# EAGLE design OGX360I-4CH - Programming Utility (EAGLE 9.6.2)
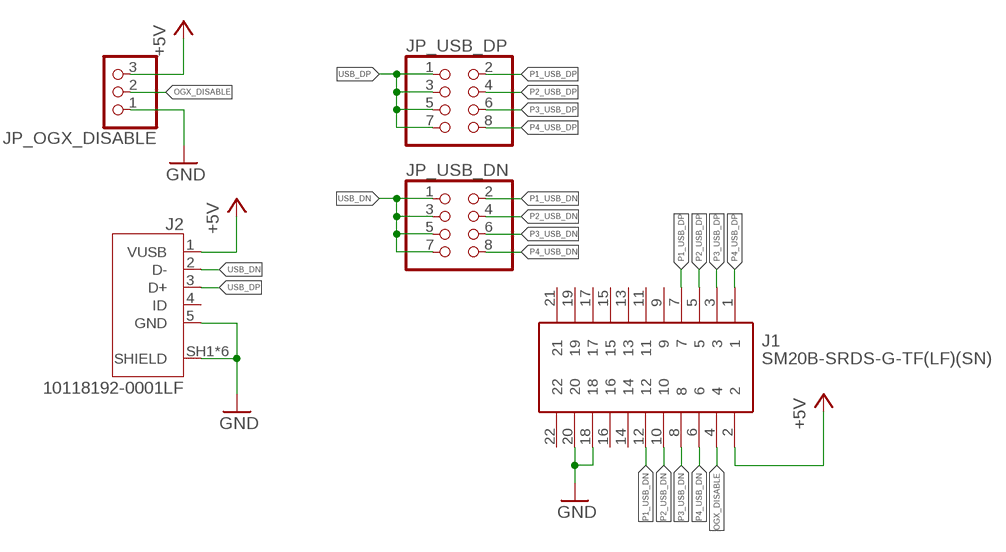
[diagram p0: schematic, sheet 1]

## Parts
J1  SM20B-SRDS-G-TF(LF)(SN)  [SM20BSRDSGTFLFSN]
J2  10118192-0001LF  [AMPHENOL_10118192-0001LF]
JP_OGX_DISABLE  PINHD-1X3  [1X03]
JP_USB_DN  PINHD-2X4  [2X04]
JP_USB_DP  PINHD-2X4  [2X04]

## Nets
+5V: J1.2 J2.1(VUSB) JP_OGX_DISABLE.3
GND: J1.18 J1.20 J2.5(GND) J2.SH1(SHIELD) J2.SH2(SHIELD) J2.SH3(SHIELD) J2.SH4(SHIELD) J2.SH5(SHIELD) J2.SH6(SHIELD) JP_OGX_DISABLE.1
OGX_DISABLE: J1.4 JP_OGX_DISABLE.2
P1_USB_DN: J1.12 JP_USB_DN.2
P1_USB_DP: J1.7 JP_USB_DP.2
P2_USB_DN: J1.10 JP_USB_DN.4
P2_USB_DP: J1.5 JP_USB_DP.4
P3_USB_DN: J1.8 JP_USB_DN.6
P3_USB_DP: J1.3 JP_USB_DP.6
P4_USB_DN: J1.6 JP_USB_DN.8
P4_USB_DP: J1.1 JP_USB_DP.8
USB_DN: J2.2(D-) JP_USB_DN.1 JP_USB_DN.3 JP_USB_DN.5 JP_USB_DN.7
USB_DP: J2.3(D+) JP_USB_DP.1 JP_USB_DP.3 JP_USB_DP.5 JP_USB_DP.7
Unconnected: J1.9 J1.11 J1.13 J1.14 J1.15 J1.16 J1.17 J1.19 J1.21 J1.22 J2.4(ID)

## Library data of the parts
J1 = SM20B-SRDS-G-TFLFSN:SM20B-SRDS-G-TF(LF)(SN): JST SHD, 1mm Pitch, 20 Way, Right Angle PCB Header, Surface Mount Source: Datasheet <http://www.jst-mfg.com/product/pdf/eng/eSHD.pdf>; DESCRIPTION: JST SHD, 1mm Pitch, 20 Way, Right Angle PCB Header, Surface Mount; HEIGHT: 5.5mm; MANUFACTURER_NAME: JST (JAPAN SOLDERLESS TERMINALS); MANUFACTURER_PART_NUMBER: SM20B-SRDS-G-TF(LF)(SN)
J2 = 10118192-0001LF:10118192-0001LF: Single Port 5 Contact Horizontal Right Angle Shielded Micro B USB 2.0 Connector Check prices <https://snapeda.com/parts/10118192-0001LF/Amphenol%20ICC%20%28FCI%29/view-part/?ref=eda>; ARROW_ELECTRONICS-PURCHASE-URL: https://snapeda.com/shop?store=Arrow+Electronics&id=4793801; AVAILABILITY: Good; DESCRIPTION: USB - micro B USB 2.0 Receptacle Connector 5 Position Surface Mount, Right Angle; DIGIKEY-PURCHASE-URL: https://snapeda.com/shop?store=DigiKey&id=4793801; MF: Amphenol ICC (FCI); MOUSER-PURCHASE-URL: https://snapeda.com/shop?store=Mouser&id=4793801; MP: 10118192-0001LF; PACKAGE: None; PRICE: None
JP_OGX_DISABLE = pinhead:PINHD-1X3: PIN HEADER
JP_USB_DN JP_USB_DP = pinhead:PINHD-2X4: PIN HEADER

## Board
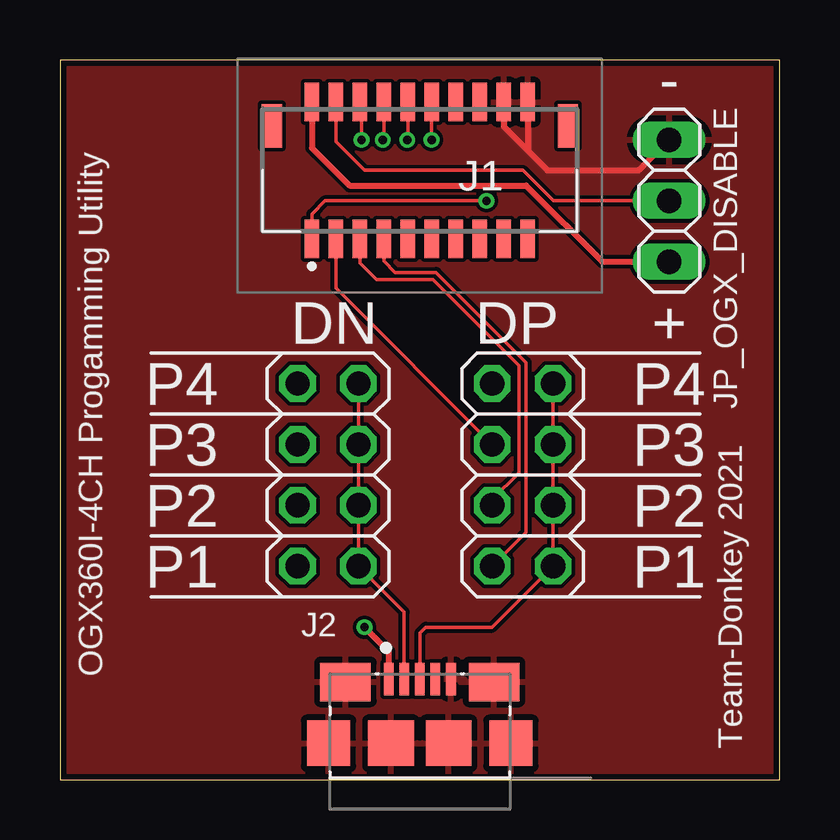
[diagram p1: board, top side]
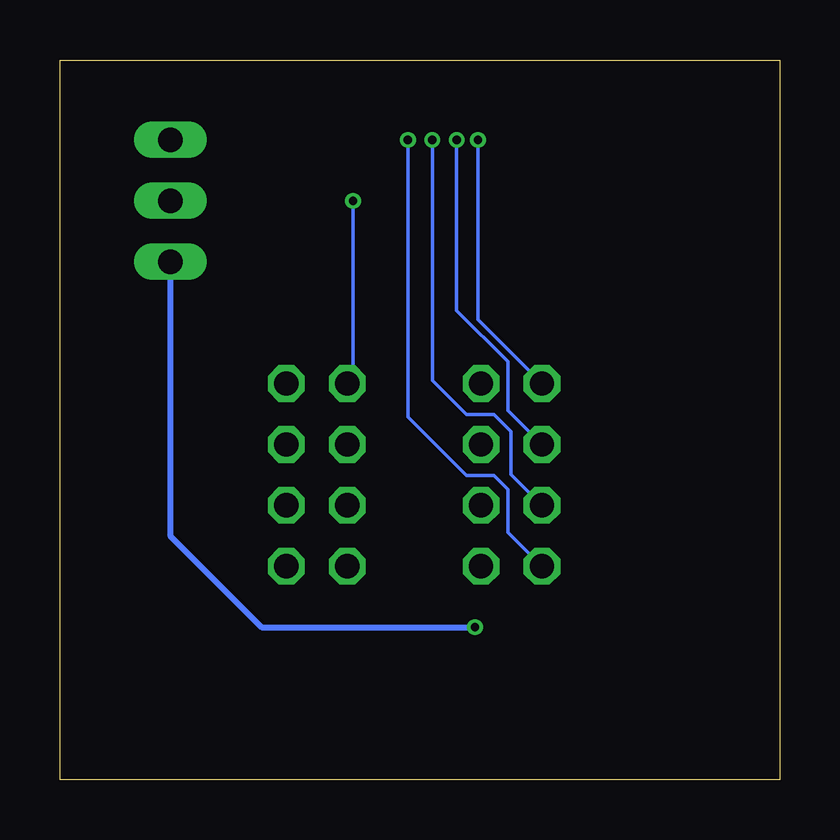
[diagram p2: board, bottom side, seen from below]

Size 30 x 30 mm. Coordinates in mm from the lower left corner, seen from the top.
Outline: 0,0 30,0 30,30 0,30 0,0
Copper layers (1*16): Top 0.035mm / dielectric 0.15mm / Bottom 0.035mm
Design rules "default": minimum track width 6mil, minimum drill 12mil, track to track 6mil, track to pad 6mil, pad to pad 6mil, via to via 6mil, smd to smd 0mil, copper to edge 10mil, drill to drill 10mil, minimum pad ring 10mil, minimum via ring 6mil, stop-mask expansion 2mil, vias tented up to drill 100mil, thermal gap 10mil

### Footprints (pad centres in the part's own frame; a part is rotated, then mirrored left to right if it is on the bottom)
SM20BSRDSGTFLFSN = smd 0.6 x 1.6: 1 4.5,2.85; 2 4.5,-2.85; 3 3.5,2.85; 4 3.5,-2.85; 5 2.5,2.85; 6 2.5,-2.85; 7 1.5,2.85; 8 1.5,-2.85; 9 0.5,2.85; 10 0.5,-2.85; 11 -0.5,2.85; 12 -0.5,-2.85; 13 -1.5,2.85; 14 -1.5,-2.85; 15 -2.5,2.85; 16 -2.5,-2.85; 17 -3.5,2.85; 18 -3.5,-2.85; 19 -4.5,2.85; 20 -4.5,-2.85 | smd 0.85 x 1.8: 21 -6.175,-1.85; 22 6.175,-1.85
AMPHENOL_10118192-0001LF = smd 0.4 x 1.35: 1 -1.3,0; 2 -0.65,0; 3 0,0; 4 0.65,0; 5 1.3,0 | smd 2.1 x 1.6: SH1 -3.1,-0.125; SH2 3.1,-0.125 | smd 1.8 x 1.9: SH3 -3.8,-2.675; SH6 3.8,-2.675 | smd 1.9 x 1.9: SH4 -1.2,-2.675; SH5 1.2,-2.675
1X03 = drill 1.016 long: 1 -2.54,0; 2 0,0; 3 2.54,0
2X04 = drill 1.016 octagon: 1 -3.81,-1.27; 2 -3.81,1.27; 3 -1.27,-1.27; 4 -1.27,1.27; 5 1.27,-1.27; 6 1.27,1.27; 7 3.81,-1.27; 8 3.81,1.27

### Placement (x,y rotation side)
J1  15,25.4 180 top
J2  15,4.19 0 top
JP_OGX_DISABLE  25.4,24.13 270 top
JP_USB_DN  11.18,12.7 90 top
JP_USB_DP  19.29,12.7 90 top

### Tracks (layer width: path | path; a pad name or v marks a point on that pad's centre or on a via)
+5V  (via drill 0.35)
  Top 0.254: J1.2 10.5,26.33 12.06,24.77 19.43,24.77 22.61,21.59 JP_OGX_DISABLE.3 | v12.7,6.35 13.7,5.35 J2.1
  Bottom 0.254: JP_OGX_DISABLE.3 25.4,10.16 21.59,6.35 v12.7,6.35
GND
  Top 0.254: J1.18 18.5,27.22 19.5,26.22 | 19.5,26.22 20.32,25.4 24.13,25.4 JP_OGX_DISABLE.1 | J1.20 19.5,26.22
  pour Top: -1.27,30.48 30.48,30.48 30.48,-1.27 -1.27,-1.27
OGX_DISABLE
  Top 0.152: J1.4 11.5,26.6 12.7,25.4 19.3,25.4 20.57,24.13 JP_OGX_DISABLE.2
P1_USB_DN  (via drill 0.35)
  Top 0.152: v15.49,26.67 J1.12
  Bottom 0.152: JP_USB_DN.2 11.33,10.31 11.33,12.09 11.91,12.68 13.06,12.68 15.49,15.11 v15.49,26.67
P1_USB_DP
  Top 0.152: J1.7 13.5,21.62 13.98,21.14 15.68,21.14 19.43,17.39 19.43,10.3 JP_USB_DP.2
P2_USB_DN  (via drill 0.35)
  Top 0.152: v14.48,26.67 14.5,26.69 J1.10
  Bottom 0.152: JP_USB_DN.4 11.2,12.72 11.2,14.51 11.91,15.21 13.06,15.21 14.48,16.63 v14.48,26.67
P2_USB_DP
  Top 0.152: J1.5 12.5,21.54 13.2,20.84 15.55,20.84 19.13,17.26 19.13,12.78 18.02,11.67 JP_USB_DP.4
P3_USB_DN  (via drill 0.35)
  Top 0.152: v13.46,26.67 13.5,26.71 J1.8
  Bottom 0.152: JP_USB_DN.6 11.33,15.39 11.33,17.43 13.46,19.56 v13.46,26.67
P3_USB_DP
  Top 0.152: JP_USB_DP.6 11.5,20.49 J1.3
P4_USB_DN  (via drill 0.35)
  Top 0.152: v12.57,26.67 12.57,28.18 J1.6
  Bottom 0.152: JP_USB_DN.8 12.57,19.18 v12.57,26.67
P4_USB_DP  (via drill 0.35)
  Top 0.152: v17.78,24.13 11.05,24.13 10.5,23.58 J1.1
  Bottom 0.152: JP_USB_DP.8 17.78,16.75 v17.78,24.13
USB_DN
  Top 0.152: J2.2 14.35,6.99 JP_USB_DN.1 JP_USB_DN.3 JP_USB_DN.5 JP_USB_DN.7
USB_DP
  Top 0.152: J2.3 15,6.11 15.24,6.35 18.02,6.35 JP_USB_DP.1 JP_USB_DP.3 JP_USB_DP.5 JP_USB_DP.7

### Text on the board
tPlace: - | DN | DP | + | P4 | P4 | OGX360I-4CH Progamming Utility | P3 | P3 | P2 | P2 | P1 | P1 | Team-Donkey 2021